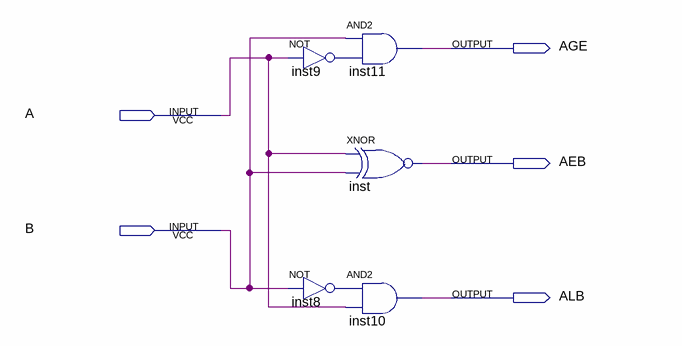
[diagram p0: schematic sheet]
// Quartus schematic compare_gate.bdf as structural Verilog: 5 symbols, 5 pins
module compare_gate (
  input  A,
  input  B,
  output AGE,
  output AEB,
  output ALB
);

  wire inst8_out, inst9_out;

  not inst9 (inst9_out, A);
  not inst8 (inst8_out, B);
  and inst11 (AGE, B, inst9_out);
  xnor inst (AEB, A, B);
  and inst10 (ALB, inst8_out, A);
endmodule
